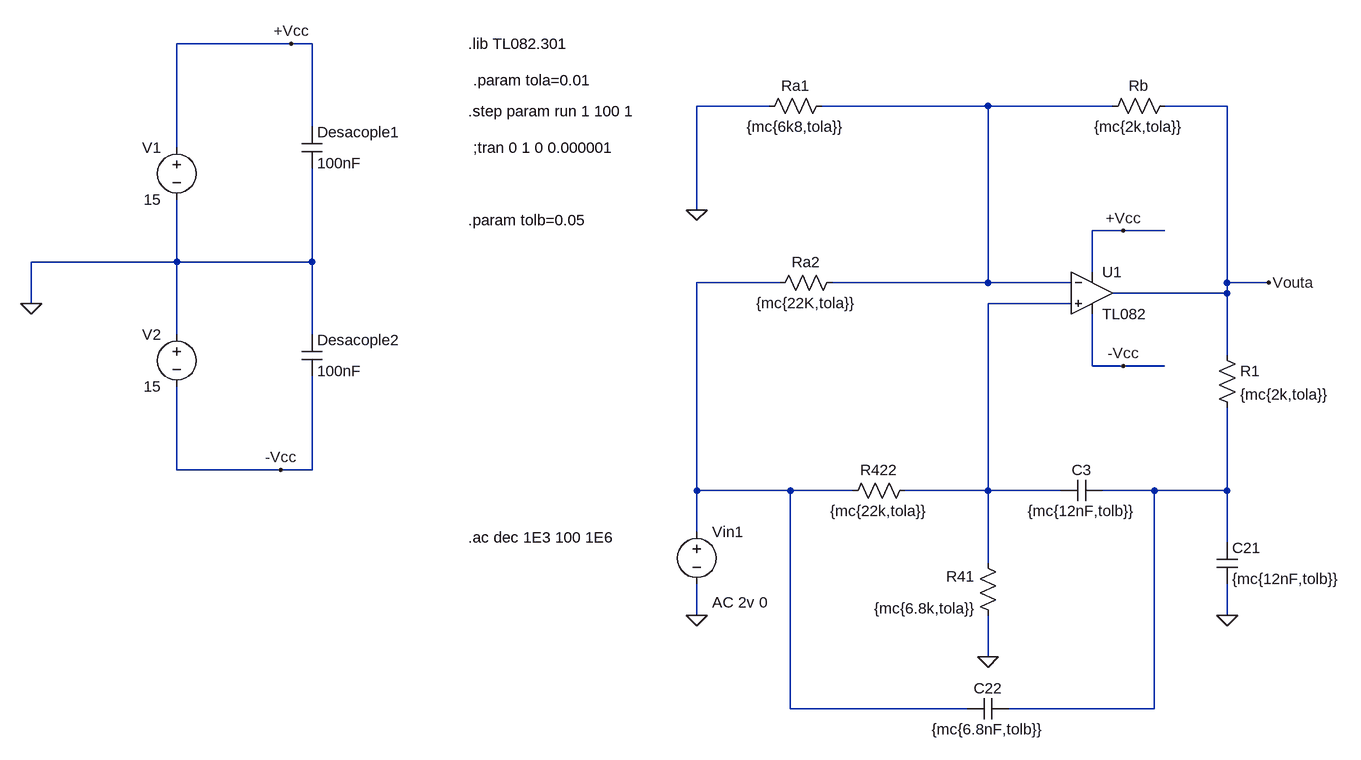
[diagram p0: schematic Sedra HPN.asc]
Sedra HPN.asc, the LTspice schematic file:
Version 4
SHEET 1 880 680
WIRE -2656 -1024 -2832 -1024
WIRE -2624 -1024 -2656 -1024
WIRE -1920 -928 -2032 -928
WIRE -1584 -928 -1840 -928
WIRE -1392 -928 -1584 -928
WIRE -1216 -928 -1312 -928
WIRE -2624 -896 -2624 -1024
WIRE -2832 -864 -2832 -1024
WIRE -2032 -768 -2032 -928
WIRE -1376 -736 -1424 -736
WIRE -1312 -736 -1376 -736
WIRE -2832 -688 -2832 -784
WIRE -2832 -688 -3056 -688
WIRE -2624 -688 -2624 -832
WIRE -2624 -688 -2832 -688
WIRE -1424 -672 -1424 -736
WIRE -1904 -656 -2032 -656
WIRE -1584 -656 -1584 -928
WIRE -1584 -656 -1824 -656
WIRE -1456 -656 -1584 -656
WIRE -1216 -656 -1216 -928
WIRE -1152 -656 -1216 -656
WIRE -1216 -640 -1216 -656
WIRE -1216 -640 -1392 -640
WIRE -3056 -624 -3056 -688
WIRE -1456 -624 -1584 -624
WIRE -2832 -576 -2832 -688
WIRE -2624 -576 -2624 -688
WIRE -1216 -544 -1216 -640
WIRE -1424 -528 -1424 -608
WIRE -1376 -528 -1424 -528
WIRE -1312 -528 -1376 -528
WIRE -2832 -368 -2832 -496
WIRE -2672 -368 -2832 -368
WIRE -2624 -368 -2624 -512
WIRE -2624 -368 -2672 -368
WIRE -2032 -336 -2032 -656
WIRE -1888 -336 -2032 -336
WIRE -1792 -336 -1888 -336
WIRE -1584 -336 -1584 -624
WIRE -1584 -336 -1712 -336
WIRE -1472 -336 -1584 -336
WIRE -1328 -336 -1408 -336
WIRE -1216 -336 -1216 -464
WIRE -1216 -336 -1328 -336
WIRE -2032 -272 -2032 -336
WIRE -1216 -256 -1216 -336
WIRE -1584 -224 -1584 -336
WIRE -2032 -144 -2032 -192
WIRE -1216 -144 -1216 -192
WIRE -1584 -80 -1584 -144
WIRE -1888 0 -1888 -336
WIRE -1616 0 -1888 0
WIRE -1328 0 -1328 -336
WIRE -1328 0 -1552 0
FLAG -3056 -624 0
FLAG -2656 -1024 +Vcc
FLAG -2672 -368 -Vcc
FLAG -2032 -768 0
FLAG -1376 -736 +Vcc
FLAG -1376 -528 -Vcc
FLAG -2032 -144 0
FLAG -1584 -80 0
FLAG -1152 -656 Vouta
FLAG -1216 -144 0
SYMBOL voltage -2832 -880 M0
WINDOW 123 0 0 Left 2
WINDOW 39 0 0 Left 2
SYMATTR InstName V1
SYMATTR Value 15
SYMBOL voltage -2832 -592 M0
WINDOW 123 0 0 Left 2
WINDOW 39 0 0 Left 2
SYMATTR InstName V2
SYMATTR Value 15
SYMBOL res -1824 -944 R90
WINDOW 0 0 56 VBottom 2
WINDOW 3 32 56 VTop 2
SYMATTR InstName Ra1
SYMATTR Value {mc{6k8,tola}}
SYMBOL res -1296 -944 R90
WINDOW 0 0 56 VBottom 2
WINDOW 3 32 56 VTop 2
SYMATTR InstName Rb
SYMATTR Value {mc{2k,tola}}
SYMBOL res -1568 -128 R180
WINDOW 0 36 76 Left 2
WINDOW 3 191 27 Right 2
SYMATTR InstName R41
SYMATTR Value {mc{6.8k,tola}}
SYMBOL Opamps\\opamp2 -1424 -704 R0
SYMATTR InstName U1
SYMATTR Value TL082
SYMBOL res -1696 -352 R90
WINDOW 0 0 56 VBottom 2
WINDOW 3 32 56 VTop 2
SYMATTR InstName R422
SYMATTR Value {mc{22k,tola}}
SYMBOL voltage -2032 -288 R0
WINDOW 123 24 124 Left 2
WINDOW 39 0 0 Left 2
WINDOW 3 24 152 Left 2
SYMATTR Value2 AC 2v 0
SYMATTR Value ""
SYMATTR InstName Vin1
SYMBOL res -1232 -560 R0
SYMATTR InstName R1
SYMATTR Value {mc{2k,tola}}
SYMBOL cap -1552 -16 R90
WINDOW 0 0 32 VBottom 2
WINDOW 3 32 32 VTop 2
SYMATTR InstName C22
SYMATTR Value {mc{6.8nF,tolb}}
SYMBOL res -1808 -672 R90
WINDOW 0 0 56 VBottom 2
WINDOW 3 32 56 VTop 2
SYMATTR InstName Ra2
SYMATTR Value {mc{22K,tola}}
SYMBOL cap -1232 -256 R0
SYMATTR InstName C21
SYMATTR Value {mc{12nF,tolb}}
SYMBOL cap -1408 -352 R90
WINDOW 0 0 32 VBottom 2
WINDOW 3 32 32 VTop 2
SYMATTR InstName C3
SYMATTR Value {mc{12nF,tolb}}
SYMBOL cap -2640 -896 R0
SYMATTR InstName Desacople1
SYMATTR Value 100nF
SYMBOL cap -2640 -576 R0
SYMATTR InstName Desacople2
SYMATTR Value 100nF
TEXT -2384 -1024 Left 2 !.lib TL082.301
TEXT -2384 -264 Left 2 !.ac dec 1E3 100 1E6
TEXT -2376 -968 Left 2 !.param tola=0.01
TEXT -2384 -920 Left 2 !.step param run 1 100 1
TEXT -2376 -864 Left 2 !;tran 0 1 0 0.000001
TEXT -2384 -752 Left 2 !.param tolb=0.05

The netlist it stands for:
* Sedra HPN.asc
V1 +Vcc 0 15
V2 0 -Vcc 15
Ra1 N001 0 {mc{6k8,tola}}
Rb Vouta N001 {mc{2k,tola}}
R41 0 N003 {mc{6.8k,tola}}
XU1 N003 N001 +Vcc -Vcc Vouta TL082  ; pins In+ In- V+ V- OUT
R422 N003 N002 {mc{22k,tola}}
Vin1 N002 0 AC 2v 0
R1 Vouta N004 {mc{2k,tola}}
C22 N004 N002 {mc{6.8nF,tolb}}
Ra2 N001 N002 {mc{22K,tola}}
C21 N004 0 {mc{12nF,tolb}}
C3 N004 N003 {mc{12nF,tolb}}
C§Desacople1 +Vcc 0 100nF
C§Desacople2 0 -Vcc 100nF
.lib TL082.301
.ac dec 1E3 100 1E6
.param tola=0.01
.step param run 1 100 1
;tran 0 1 0 0.000001
.param tolb=0.05
.backanno
.end